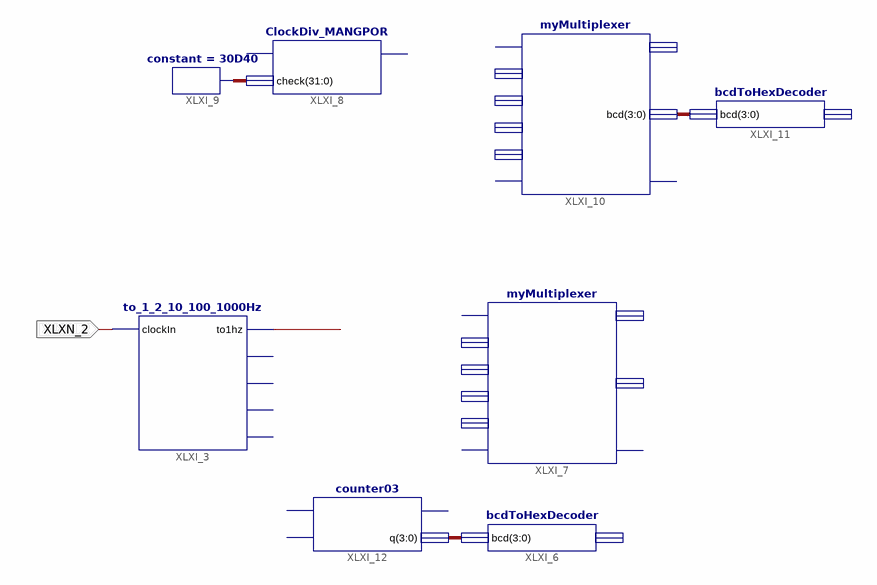
[diagram p0: schematic sheet 1]
// Xilinx ISE schematic test.sch (spartan6) as structural Verilog: 8 symbols, 1 ports
module test (
  input  XLXN_2
);

  wire XLXN_1;
  wire [3:0] XLXN_8, XLXN_10;
  wire [31:0] XLXN_7;

  to_1_2_10_100_1000Hz XLXI_3 (.clockIn(XLXN_2), .to1hz(XLXN_1));  // open: to2hz, to10hz, to100hz, to1000hz
  bcdToHexDecoder XLXI_6 (.bcd(XLXN_10));  // open: bit
  myMultiplexer XLXI_7 ();  // open: CLOCK, timeCom0, timeCom1, timeCom2, timeCom3, beepIn, common, bcd, beepOut
  ClockDiv_MANGPOR XLXI_8 (.check(XLXN_7));  // open: CLK, outCLK
  constant #(.CValue("30D40")) XLXI_9 (.O(XLXN_7));
  myMultiplexer XLXI_10 (.bcd(XLXN_8));  // open: CLOCK, timeCom0, timeCom1, timeCom2, timeCom3, beepIn, common, beepOut
  bcdToHexDecoder XLXI_11 (.bcd(XLXN_8));  // open: bit
  counter03 XLXI_12 (.q(XLXN_10));  // open: clear, clk_in, devide_4
endmodule
